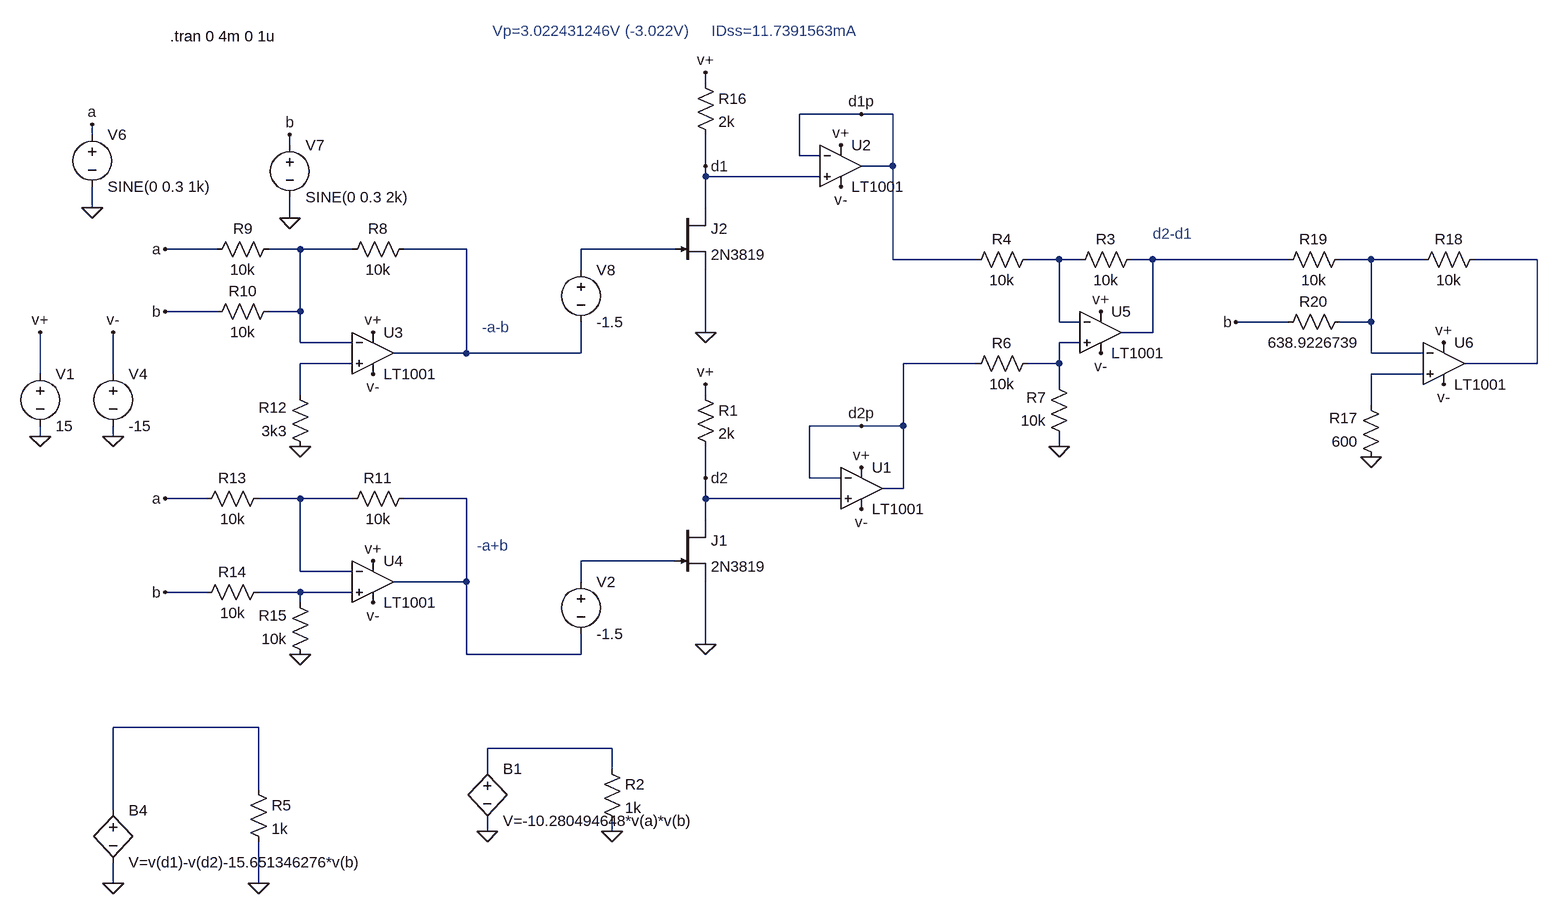
[diagram p0: schematic mult4c_jfet2.asc]
mult4c_jfet2.asc, the LTspice schematic file:
Version 4
SHEET 1 2756 868
WIRE -592 -672 -592 -688
WIRE -352 -624 -448 -624
WIRE -304 -624 -352 -624
WIRE -1536 -592 -1536 -608
WIRE -1232 -576 -1232 -592
WIRE -448 -560 -448 -624
WIRE -416 -560 -448 -560
WIRE -592 -544 -592 -592
WIRE -304 -544 -304 -624
WIRE -304 -544 -352 -544
WIRE -592 -528 -592 -544
WIRE -416 -528 -592 -528
WIRE -1536 -480 -1536 -512
WIRE -592 -480 -592 -528
WIRE -1232 -464 -1232 -496
WIRE -1344 -416 -1424 -416
WIRE -1216 -416 -1264 -416
WIRE -1136 -416 -1216 -416
WIRE -960 -416 -1056 -416
WIRE -640 -416 -784 -416
WIRE -304 -400 -304 -544
WIRE -176 -400 -304 -400
WIRE -48 -400 -96 -400
WIRE -16 -400 -48 -400
WIRE 96 -400 64 -400
WIRE 304 -400 96 -400
WIRE 432 -400 384 -400
WIRE 512 -400 432 -400
WIRE 688 -400 592 -400
WIRE -784 -384 -784 -416
WIRE -1344 -320 -1424 -320
WIRE -1216 -320 -1216 -416
WIRE -1216 -320 -1264 -320
WIRE -48 -304 -48 -400
WIRE -16 -304 -48 -304
WIRE 304 -304 224 -304
WIRE 432 -304 432 -400
WIRE 432 -304 384 -304
WIRE -592 -288 -592 -384
WIRE 96 -288 96 -400
WIRE 96 -288 48 -288
WIRE -1216 -272 -1216 -320
WIRE -1136 -272 -1216 -272
WIRE -16 -272 -48 -272
WIRE -960 -256 -960 -416
WIRE -960 -256 -1072 -256
WIRE -784 -256 -784 -304
WIRE -784 -256 -960 -256
WIRE 432 -256 432 -304
WIRE 512 -256 432 -256
WIRE -1136 -240 -1216 -240
WIRE -176 -240 -288 -240
WIRE -48 -240 -48 -272
WIRE -48 -240 -96 -240
WIRE 688 -240 688 -400
WIRE 688 -240 576 -240
WIRE -1616 -224 -1616 -288
WIRE -1504 -224 -1504 -288
WIRE 512 -224 432 -224
WIRE -48 -208 -48 -240
WIRE -1216 -192 -1216 -240
WIRE -592 -192 -592 -208
WIRE 432 -176 432 -224
WIRE -352 -144 -432 -144
WIRE -288 -144 -288 -240
WIRE -288 -144 -352 -144
WIRE -1616 -128 -1616 -144
WIRE -1504 -128 -1504 -144
WIRE -48 -112 -48 -128
WIRE -592 -64 -592 -112
WIRE -432 -64 -432 -144
WIRE -384 -64 -432 -64
WIRE -288 -48 -288 -144
WIRE -288 -48 -320 -48
WIRE -1360 -32 -1424 -32
WIRE -1216 -32 -1280 -32
WIRE -1136 -32 -1216 -32
WIRE -960 -32 -1056 -32
WIRE -592 -32 -592 -64
WIRE -384 -32 -592 -32
WIRE -592 0 -592 -32
WIRE -640 64 -784 64
WIRE -1216 80 -1216 -32
WIRE -1136 80 -1216 80
WIRE -960 96 -960 -32
WIRE -960 96 -1072 96
WIRE -784 96 -784 64
WIRE -1360 112 -1424 112
WIRE -1216 112 -1280 112
WIRE -1136 112 -1216 112
WIRE -1216 128 -1216 112
WIRE -592 192 -592 96
WIRE -960 208 -960 96
WIRE -784 208 -784 176
WIRE -784 208 -960 208
WIRE -1280 320 -1504 320
WIRE -736 352 -928 352
WIRE -928 384 -928 352
WIRE -736 384 -736 352
WIRE -1280 416 -1280 320
WIRE -1504 448 -1504 320
WIRE -928 480 -928 464
WIRE -736 480 -736 464
WIRE -1504 560 -1504 528
WIRE -1280 560 -1280 496
FLAG -592 192 0
FLAG -1616 -128 0
FLAG -592 -64 d2
FLAG -1504 560 0
FLAG -1280 560 0
FLAG -1616 -288 v+
FLAG -1504 -128 0
FLAG -1504 -288 v-
FLAG -1104 -288 v+
FLAG -1104 64 v+
FLAG -1104 -224 v-
FLAG -1104 128 v-
FLAG -1216 -112 0
FLAG -1424 -416 a
FLAG -1424 -320 b
FLAG -1216 208 0
FLAG -1424 -32 a
FLAG -1424 112 b
FLAG -1536 -480 0
FLAG -1536 -608 a
FLAG -1232 -464 0
FLAG -1232 -592 b
FLAG -592 -288 0
FLAG -592 -544 d1
FLAG -592 -688 v+
FLAG -592 -208 v+
FLAG -928 480 0
FLAG -736 480 0
FLAG -352 -80 v+
FLAG -352 -16 v-
FLAG -384 -576 v+
FLAG -384 -512 v-
FLAG 16 -320 v+
FLAG 16 -256 v-
FLAG -48 -112 0
FLAG -352 -144 d2p
FLAG -352 -624 d1p
FLAG 544 -272 v+
FLAG 544 -208 v-
FLAG 432 -96 0
FLAG 224 -304 b
SYMBOL njf -640 0 R0
SYMATTR InstName J1
SYMATTR Value 2N3819
SYMBOL voltage -1616 -240 R0
WINDOW 123 0 0 Left 0
WINDOW 39 0 0 Left 0
SYMATTR InstName V1
SYMATTR Value 15
SYMBOL voltage -784 80 R0
WINDOW 123 0 0 Left 0
WINDOW 39 0 0 Left 0
SYMATTR InstName V2
SYMATTR Value -1.5
SYMBOL res -608 -208 R0
SYMATTR InstName R1
SYMATTR Value 2k
SYMBOL bv -1504 432 R0
SYMATTR InstName B4
SYMATTR Value V=v(d1)-v(d2)-15.651346276*v(b)
SYMBOL res -1296 400 R0
SYMATTR InstName R5
SYMATTR Value 1k
SYMBOL voltage -1504 -240 R0
WINDOW 123 0 0 Left 0
WINDOW 39 0 0 Left 0
SYMATTR InstName V4
SYMATTR Value -15
SYMBOL OpAmps\\LT1001 -1104 -320 R0
SYMATTR InstName U3
SYMBOL OpAmps\\LT1001 -1104 32 R0
SYMATTR InstName U4
SYMBOL res -1200 -96 R180
WINDOW 0 36 76 Left 2
WINDOW 3 36 40 Left 2
SYMATTR InstName R12
SYMATTR Value 3k3
SYMBOL res -1040 -432 R90
WINDOW 0 0 56 VBottom 2
WINDOW 3 32 56 VTop 2
SYMATTR InstName R8
SYMATTR Value 10k
SYMBOL res -1248 -432 R90
WINDOW 0 0 56 VBottom 2
WINDOW 3 32 56 VTop 2
SYMATTR InstName R9
SYMATTR Value 10k
SYMBOL res -1248 -336 R90
WINDOW 0 0 56 VBottom 2
WINDOW 3 32 56 VTop 2
SYMATTR InstName R10
SYMATTR Value 10k
SYMBOL res -1040 -48 R90
WINDOW 0 0 56 VBottom 2
WINDOW 3 32 56 VTop 2
SYMATTR InstName R11
SYMATTR Value 10k
SYMBOL res -1264 -48 R90
WINDOW 0 0 56 VBottom 2
WINDOW 3 32 56 VTop 2
SYMATTR InstName R13
SYMATTR Value 10k
SYMBOL res -1264 96 R90
WINDOW 0 0 56 VBottom 2
WINDOW 3 32 56 VTop 2
SYMATTR InstName R14
SYMATTR Value 10k
SYMBOL res -1200 224 R180
WINDOW 0 36 76 Left 2
WINDOW 3 36 40 Left 2
SYMATTR InstName R15
SYMATTR Value 10k
SYMBOL voltage -1536 -608 R0
WINDOW 123 0 0 Left 0
WINDOW 39 0 0 Left 0
SYMATTR InstName V6
SYMATTR Value SINE(0 0.3 1k)
SYMBOL voltage -1232 -592 R0
WINDOW 123 0 0 Left 0
WINDOW 39 0 0 Left 0
SYMATTR InstName V7
SYMATTR Value SINE(0 0.3 2k)
SYMBOL njf -640 -480 R0
SYMATTR InstName J2
SYMATTR Value 2N3819
SYMBOL voltage -784 -400 R0
WINDOW 123 0 0 Left 0
WINDOW 39 0 0 Left 0
SYMATTR InstName V8
SYMATTR Value -1.5
SYMBOL res -608 -688 R0
SYMATTR InstName R16
SYMATTR Value 2k
SYMBOL bv -928 368 R0
SYMATTR InstName B1
SYMATTR Value V=-10.280494648*v(a)*v(b)
SYMBOL res -752 368 R0
SYMATTR InstName R2
SYMATTR Value 1k
SYMBOL OpAmps\\LT1001 -352 -112 R0
SYMATTR InstName U1
SYMBOL OpAmps\\LT1001 -384 -608 R0
SYMATTR InstName U2
SYMBOL OpAmps\\LT1001 16 -352 R0
SYMATTR InstName U5
SYMBOL res -80 -416 R90
WINDOW 0 0 56 VBottom 2
WINDOW 3 32 56 VTop 2
SYMATTR InstName R4
SYMATTR Value 10k
SYMBOL res -80 -256 R90
WINDOW 0 0 56 VBottom 2
WINDOW 3 32 56 VTop 2
SYMATTR InstName R6
SYMATTR Value 10k
SYMBOL res -32 -112 R180
WINDOW 0 36 76 Left 2
WINDOW 3 36 40 Left 2
SYMATTR InstName R7
SYMATTR Value 10k
SYMBOL res 80 -416 R90
WINDOW 0 0 56 VBottom 2
WINDOW 3 32 56 VTop 2
SYMATTR InstName R3
SYMATTR Value 10k
SYMBOL OpAmps\\LT1001 544 -304 R0
SYMATTR InstName U6
SYMBOL res 448 -80 R180
WINDOW 0 36 76 Left 2
WINDOW 3 36 40 Left 2
SYMATTR InstName R17
SYMATTR Value 600
SYMBOL res 608 -416 R90
WINDOW 0 0 56 VBottom 2
WINDOW 3 32 56 VTop 2
SYMATTR InstName R18
SYMATTR Value 10k
SYMBOL res 400 -416 R90
WINDOW 0 0 56 VBottom 2
WINDOW 3 32 56 VTop 2
SYMATTR InstName R19
SYMATTR Value 10k
SYMBOL res 400 -320 R90
WINDOW 0 0 56 VBottom 2
WINDOW 3 32 56 VTop 2
SYMATTR InstName R20
SYMATTR Value 638.9226739
TEXT -920 -752 Left 2 ;Vp=3.022431246V (-3.022V)     IDss=11.7391563mA
TEXT -1416 -744 Left 2 !.tran 0 4m 0 1u
TEXT -936 -296 Left 2 ;-a-b
TEXT -944 40 Left 2 ;-a+b
TEXT 96 -440 Left 2 ;d2-d1

The netlist it stands for:
* mult4c_jfet2.asc
J1 d2 N013 0 2N3819
V1 v+ 0 15
V2 N013 N012 -1.5
R1 v+ d2 2k
B4 N015 0 V=v(d1)-v(d2)-15.651346276*v(b)
R5 N015 0 1k
V4 v- 0 -15
XU3 N009 N001 v+ v- N002 LT1001  ; pins In+ In- V+ V- OUT
XU4 N014 N011 v+ v- N012 LT1001  ; pins In+ In- V+ V- OUT
R12 0 N009 3k3
R8 N002 N001 10k
R9 N001 a 10k
R10 N001 b 10k
R11 N012 N011 10k
R13 N011 a 10k
R14 N014 b 10k
R15 0 N014 10k
V6 a 0 SINE(0 0.3 1k)
V7 b 0 SINE(0 0.3 2k)
J2 d1 N003 0 2N3819
V8 N003 N002 -1.5
R16 v+ d1 2k
B1 N016 0 V=-10.280494648*v(a)*v(b)
R2 N016 0 1k
XU1 d2 d2p v+ v- d2p LT1001  ; pins In+ In- V+ V- OUT
XU2 d1 d1p v+ v- d1p LT1001  ; pins In+ In- V+ V- OUT
XU5 N008 N004 v+ v- N005 LT1001  ; pins In+ In- V+ V- OUT
R4 N004 d1p 10k
R6 N008 d2p 10k
R7 0 N008 10k
R3 N005 N004 10k
XU6 N010 N006 v+ v- N007 LT1001  ; pins In+ In- V+ V- OUT
R17 0 N010 600
R18 N007 N006 10k
R19 N006 N005 10k
R20 N006 b 638.9226739
.model NJF NJF
.model PJF PJF
.lib standard.jft
* Vp=3.022431246V (-3.022V)     IDss=11.7391563mA
.tran 0 4m 0 1u
* -a-b
* -a+b
* d2-d1
.lib LTC.lib
.backanno
.end